# EAGLE design tag_key-v1 (EAGLE 7.6.0)
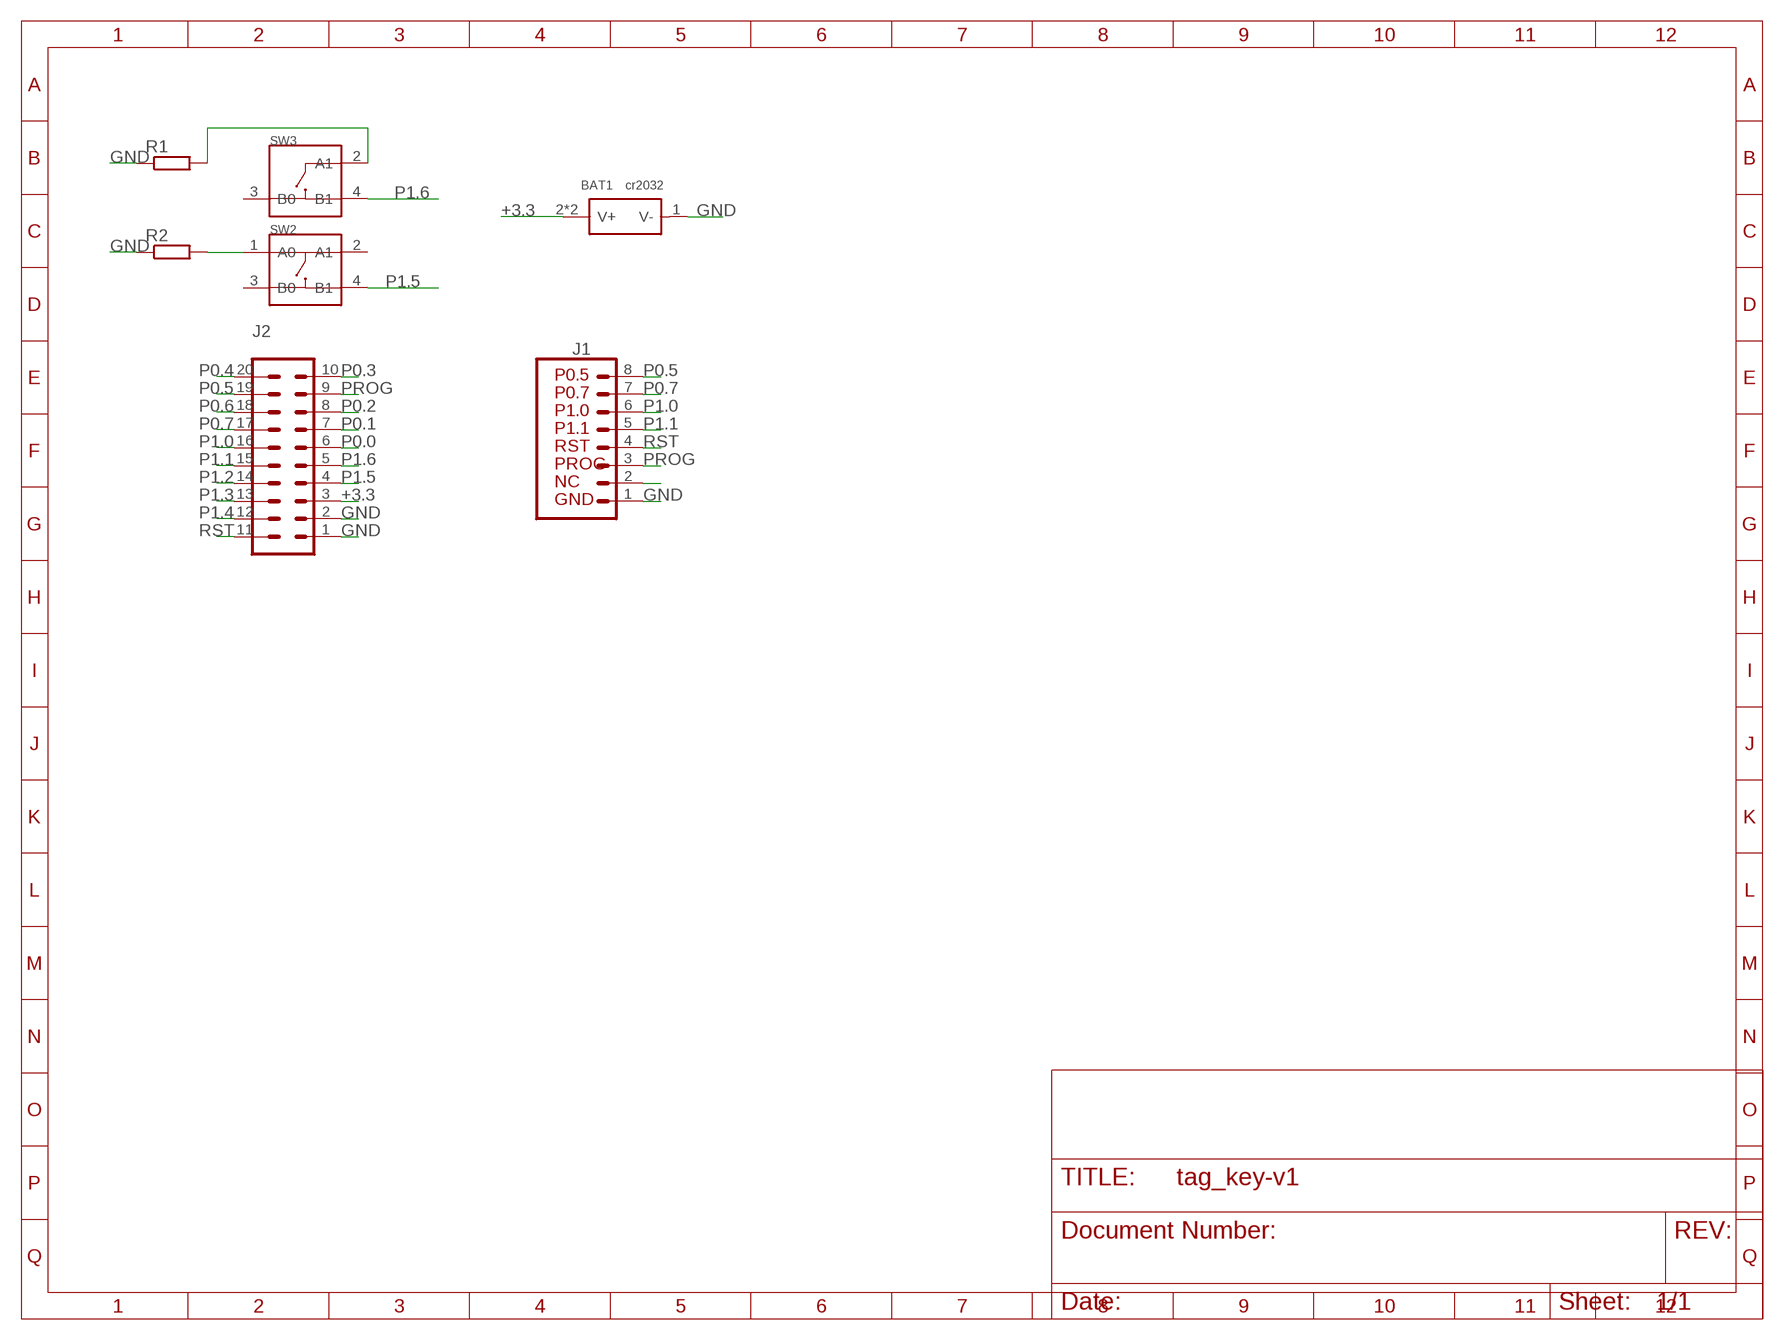
[diagram p0: schematic, sheet 1]

## Parts
BAT1  cr2032  SEEED-OPL-CONNECTOR_DIP-BATTERY-CELL-HOLDER(2032)  [SEEED-OPL-CONNECTOR_BAT2P-20.32-CR2032]
J1  SPARKFUN-CONNECTORS_CONN_08"  [SPARKFUN-CONNECTORS_1X08]
J2  SPARKFUN-CONNECTORS_CONN_11_1.27MM  [SPARKFUN-CONNECTORS_1X11-1.27MM]
R1  RESISTOR_R-EU_M0805  [RESISTOR_M0805]
R2  RESISTOR_R-EU_M0805  [RESISTOR_M0805]
SW2  SEEED-OPL-SWITCH_SMD-BUTTON(4P-6.0X6.0X7.5MM)  [SEEED-OPL-SWITCH_SW4-SMD-4.5-6.0X6.0X7.5MM]
SW3  SEEED-OPL-SWITCH_SMD-BUTTON(4P-6.0X6.0X3LEGM)  [SEEED-OPL-SWITCH_SW4-SMD-4.5-6.0X6.0_3LEG]

## Nets
+3.3: BAT1.2(V+) BAT1.3(V+) J2.3
GND: BAT1.1(V-) J1.1 J2.1 J2.2 R1.1 R2.1
N$1: R2.2 SW2.1(A0)
N$2: R1.2 SW3.2(A1)
N$6: J1.2
P0.0: J2.6
P0.1: J2.7
P0.2: J2.8
P0.3: J2.10
P0.4: J2.20
P0.5: J1.8 J2.19
P0.6: J2.18
P0.7: J1.7 J2.17
P1.0: J1.6 J2.16
P1.1: J1.5 J2.15
P1.2: J2.14
P1.3: J2.13
P1.4: J2.12
P1.5: J2.4 SW2.4(B1)
P1.6: J2.5 SW3.4(B1)
PROG: J1.3 J2.9
RST: J1.4 J2.11
Unconnected: SW2.2(A1) SW2.3(B0) SW3.3(B0)

## Library data of the parts
BAT1 = tag_key:SEEED-OPL-CONNECTOR_DIP-BATTERY-CELL-HOLDER(2032): 320170003
J1 = tag_key:SPARKFUN-CONNECTORS_CONN_08: Multi connection point. Often used as Generic Header-pin footprint for 0.1 inch spaced/style header connections On any of the 0.1 inch spaced packages, you can populate with these: Break Away Headers - Straight <https://www.sparkfun.com/products/116> (PRT-00116) Break Away Male Headers - Right Angle <https://www.sparkfun.com/products/553> (PRT-00553) Female Headers <https://www.sparkfun.com/products/115> (PRT-00115) Break Away Headers - Machine Pin <https://www.sparkfun.com/products/117> (PRT-00117) Break Away Female Headers - Swiss Machine Pin <https://www.sparkfun.com/products/743> (PRT-00743) Arduino Stackable Header - 8 Pin <https://www.sparkfun.com/products/9279> (PRT-09279) For SCREWTERMINALS and SPRING TERMINALS visit here: Screw Terimnals on SparkFun.com <https://www.sparkfun.com/search/results?term=Screw+Terminals> (5mm/3.5mm/2.54mm spacing) This device is also useful as a general connection point to wire up your design to another part of your project. Our various solder wires solder well into these plated through hole pads. Hook-Up Wire - Assortment (Stranded, 22 AWG) <https://www.sparkfun.com/products/11375> (PRT-11375) Hook-Up Wire - Assortment (Solid Core, 22 AWG) <https://www.sparkfun.com/products/11367> (PRT-11367) View the entire wire category on our website here <https://www.sparkfun.com/categories/141> Special notes: Molex polarized connector foot print use with SKU : PRT-08231 with associated crimp pins and housings. 1MM SMD Version SKU: PRT-10208 NOTES ON THE VARIANTS LOCK and LOCK_LONGPADS... This footprint was designed to help hold the alignment of a through-hole component (i.e. 6-pin header) while soldering it into place. You may notice that each hole has been shifted either up or down by 0.005 of an inch from it's more standard position (which is a perfectly straight line). This slight alteration caused the pins (the squares in the middle) to touch the edges of the holes. Because they are alternating, it causes a "brace" to hold the component in place. 0.005 has proven to be the perfect amount of "off-center" position when using our standard breakaway headers. Although looks a little odd when you look at the bare footprint, once you have a header in there, the alteration is very hard to notice. Also,if you push a header all the way into place, it is covered up entirely on the bottom side.; PROD_ID: CONN-08438
J2 = tag_key:SPARKFUN-CONNECTORS_CONN_11: Multi connection point. Often used as Generic Header-pin footprint for 0.1 inch spaced/style header connections On any of the 0.1 inch spaced packages, you can populate with these: Break Away Headers - Straight <https://www.sparkfun.com/products/116> (PRT-00116) Break Away Male Headers - Right Angle <https://www.sparkfun.com/products/553> (PRT-00553) Female Headers <https://www.sparkfun.com/products/115> (PRT-00115) Break Away Headers - Machine Pin <https://www.sparkfun.com/products/117> (PRT-00117) Break Away Female Headers - Swiss Machine Pin <https://www.sparkfun.com/products/743> (PRT-00743) For SCREWTERMINALS and SPRING TERMINALS visit here: Screw Terimnals on SparkFun.com <https://www.sparkfun.com/search/results?term=Screw+Terminals> (5mm/3.5mm/2.54mm spacing) This device is also useful as a general connection point to wire up your design to another part of your project. Our various solder wires solder well into these plated through hole pads. Hook-Up Wire - Assortment (Stranded, 22 AWG) <https://www.sparkfun.com/products/11375> (PRT-11375) Hook-Up Wire - Assortment (Solid Core, 22 AWG) <https://www.sparkfun.com/products/11367> (PRT-11367) View the entire wire category on our website here <https://www.sparkfun.com/categories/141>
R1 R2 = tag_key:RESISTOR_R-EU_: RESISTOR, European symbol
SW2 = tag_key:SEEED-OPL-SWITCH_SMD-BUTTON(4P-6.0X6.0X7.5MM): 311020022
SW3 = tag_key:SEEED-OPL-SWITCH_SMD-BUTTON(4P-6.0X6.0X3LEGM): 311020022

## Board
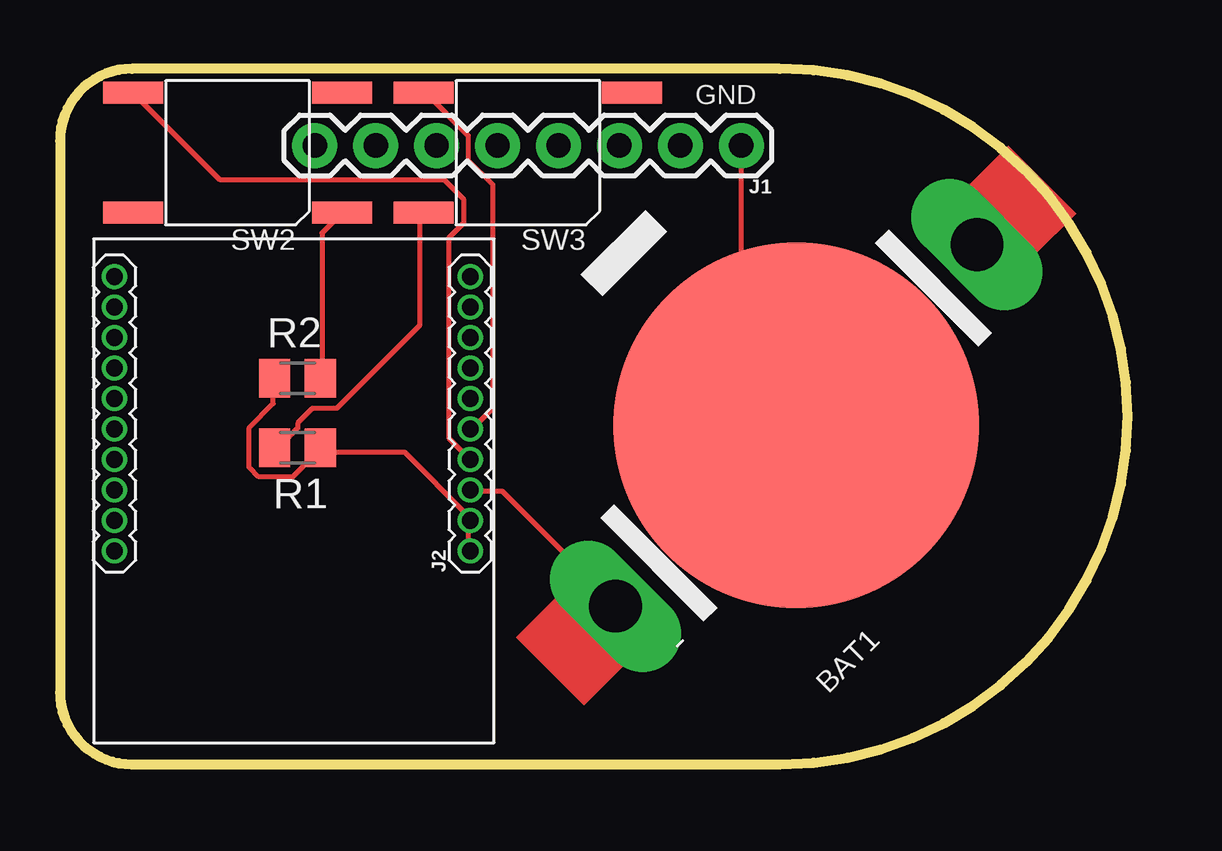
[diagram p1: board, top side]
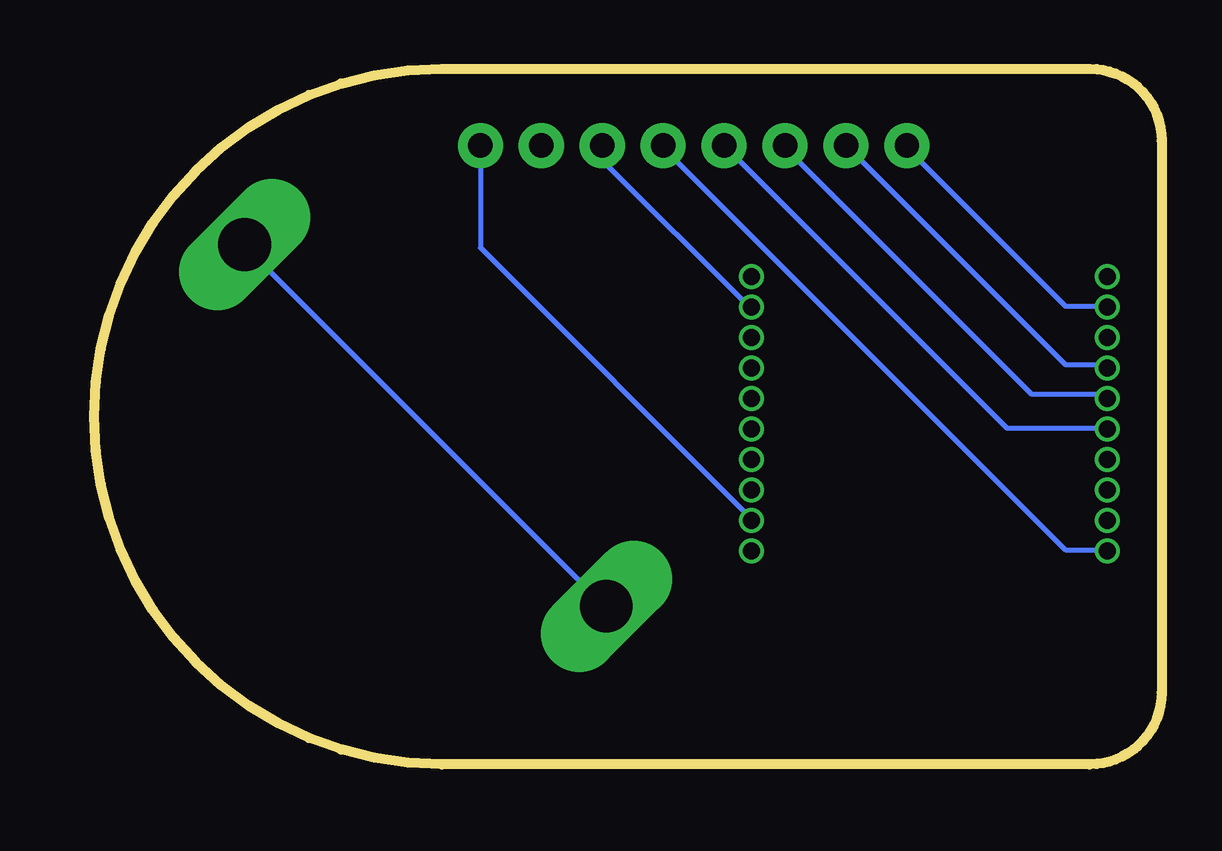
[diagram p2: board, bottom side, seen from below]

Size 44.5 x 29 mm. Coordinates in mm from the lower left corner, seen from the top.
Outline: 3,0 30,0 arc180 30,29 3,29 arc90 0,26 0,3 arc90 3,0
Copper layers (1*16): Top 0.035mm / dielectric 1.5mm / Bottom 0.035mm
Design rules "default *": minimum track width 8mil, minimum drill 24mil, track to track 8mil, track to pad 7mil, pad to pad 8mil, via to via 6mil, smd to smd 8mil, copper to edge 8mil, drill to drill 8mil, minimum pad ring 6mil, minimum via ring 8mil, stop-mask expansion 4mil, vias tented up to drill 0mil, thermal gap 10mil

### Footprints (pad centres in the part's own frame; a part is rotated, then mirrored left to right if it is on the bottom)
SEEED-OPL-CONNECTOR_BAT2P-20.32-CR2032 = smd 15.24 x 15.24: 1 0,0 | drill 2.2 pad 3.048 long: 2 -10.66,0; 3 10.66,0
SPARKFUN-CONNECTORS_1X08 = drill 1.016 pad 1.88: 1 0,0; 2 2.54,0; 3 5.08,0; 4 7.62,0; 5 10.16,0; 6 12.7,0; 7 15.24,0; 8 17.78,0
SPARKFUN-CONNECTORS_1X11-1.27MM = drill 0.7 pad 1.016: 1 0,0; 2 1.27,0; 3 2.54,0; 4 3.81,0; 5 5.08,0; 6 6.35,0; 7 7.62,0; 8 8.89,0; 9 10.16,0; 10 11.43,0; 11 0,14.83; 12 1.27,14.83; 13 2.54,14.83; 14 3.81,14.83; 15 5.08,14.83; 16 6.35,14.83; 17 7.62,14.83; 18 8.89,14.83; 19 10.16,14.83; 20 11.43,14.83
RESISTOR_M0805 = smd 1.3 x 1.6: 1 -0.95,0; 2 0.95,0
SEEED-OPL-SWITCH_SW4-SMD-4.5-6.0X6.0X7.5MM = smd 2.5 x 0.9: 1 -4.35,2.5; 2 4.35,2.5; 3 -4.35,-2.5; 4 4.35,-2.5
SEEED-OPL-SWITCH_SW4-SMD-4.5-6.0X6.0_3LEG = smd 2.5 x 0.9: 2 4.35,2.5; 3 -4.35,-2.5; 4 4.35,-2.5

### Placement (x,y rotation side)
BAT1  30.69,14.13 45 top
J1  28.4,25.8 180 top
J2  17.1,8.9 90 top
R1  9.9,13.2 180 top
R2  9.9,16.1 0 top
SW2  7.4,25.5 180 top
SW3  19.5,25.5 180 top

### Tracks (layer width: path | path; a pad name or v marks a point on that pad's centre or on a via)
+3.3
  Top 0.203: J2.3 17.22,11.38 18.44,11.38 23.12,6.71 BAT1.2
  Bottom 0.203: BAT1.3 38.15,21.54 23.32,6.71 BAT1.2
GND
  Top 0.203: R2.1 8.89,16.05 8.89,15.04 7.88,14.02 7.88,12.39 8.28,11.99 9.71,11.99 10.72,13.01 R1.1 10.93,13.01 14.38,13.01 17.02,10.36 J2.2 17.02,10.16 17.02,8.94 J2.1 | J1.1 28.4,16.46 30.64,14.22 BAT1.1
  Bottom 0.203: J1.1 28.4,21.54 17.22,10.36 J2.2
N$1
  Top 0.203: R2.2 10.93,16.26 10.93,22.15 11.74,22.96 SW2.1
N$2
  Top 0.203: R1.2 9.1,13.21 9.91,14.02 9.91,14.22 10.52,14.83 11.53,14.83 14.99,18.29 14.99,22.96 SW3.2
P0.5
  Bottom 0.203: J2.19 2.39,19.1 4.02,19.1 10.52,25.6 J1.8
P0.7
  Bottom 0.203: J2.17 2.39,16.66 4.02,16.66 12.96,25.6 J1.7
  Bottom 0.254: 13.06,25.6 J1.7
P1.0
  Bottom 0.203: J2.16 2.39,15.44 5.44,15.44 15.6,25.6 J1.6
P1.1
  Bottom 0.203: J2.15 2.39,14.02 6.45,14.02 18.04,25.6 J1.5
  Bottom 0.254: 18.09,25.6 J1.5
P1.5
  Top 0.203: J2.4 17.02,12.8 16.21,13.61 16.21,21.95 16.82,22.55 16.82,23.57 16.01,24.38 6.66,24.38 3.2,27.84 SW2.4
P1.6
  Top 0.203: J2.5 17.22,14.02 18.04,14.83 18.04,24.18 17.02,25.2 17.02,26.21 15.19,28.04 SW3.4
PROG
  Bottom 0.203: J1.3 23.32,25.2 17.22,19.1 J2.9
RST
  Bottom 0.203: J2.11 2.39,8.94 4.02,8.94 20.68,25.6 J1.4